# Altium schematic sheet PCIe.SchDoc: SPEC-A7
size 420 x 297 mm; Author: G.Kasprowicz; CompanyName: WUT ISE; DrawnBy: G.Kasprowicz; Organization: WUT ISE; Address1: PW ISE; Address2: Nowowiejska 15/19 00-665 Warsaw; Address3: gkasprow@gmail.com; Revision: 2; SheetNumber: 13; SheetTotal: 18; ModifiedBy: -; CheckedDate: -; Title2: PCIe connector; DivGrp: WUT ISE; Designer: G.Kasprowicz; ModifiedDate: -; ProjectName: Sensor Box
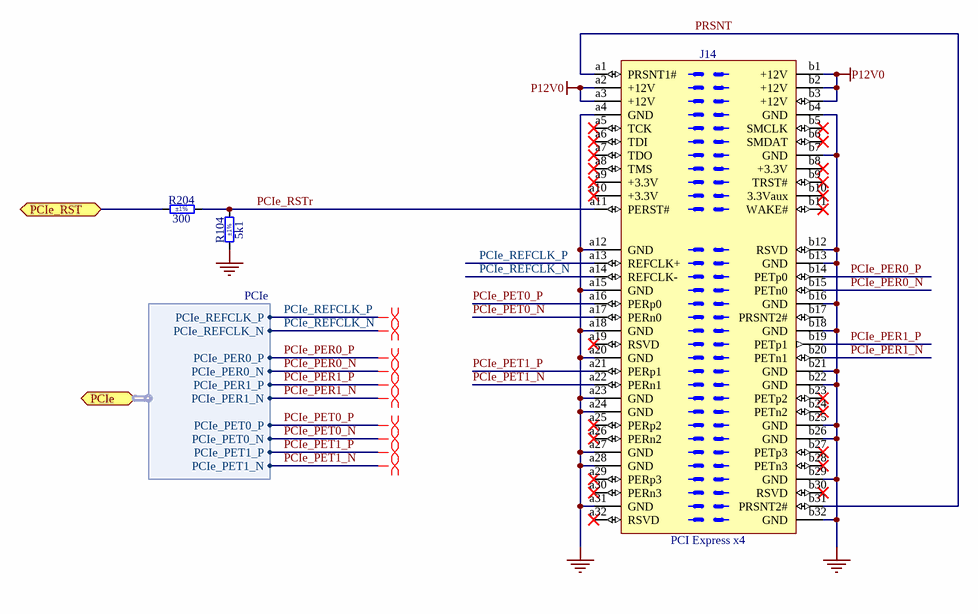
[diagram p0: PCIe.SchDoc]

## Parts
J14  PCI Express x4  [PCI Express x4]
R104  5k1  Tolerance: ±1%  [RESC1005X40N]
R204  300  Tolerance: ±1%  [RESC1005X40N]

## Ports
PCIe (bidir, harness PCIe, see SPEC-A7-TOP[2D], FPGA_MGT[2E]), PCIe_RST (bidir, see SPEC-A7-TOP[2D], FPGA_34[4D])

## Harnesses
PCIe: PCIe_REFCLK_P, PCIe_REFCLK_N, PCIe_PER0_P, PCIe_PER0_N, PCIe_PER1_P, PCIe_PER1_N, PCIe_PET0_P, PCIe_PET0_N, PCIe_PET1_P, PCIe_PET1_N

## Nets
GND: J14.a4(GND) J14.a12(GND) J14.a15(GND) J14.a18(GND) J14.a20(GND) J14.a23(GND) J14.a24(GND) J14.a27(GND) J14.a28(GND) J14.a31(GND) J14.b4(GND) J14.b7(GND) J14.b12(RSVD) J14.b13(GND) J14.b16(GND) J14.b18(GND) J14.b21(GND) J14.b22(GND) J14.b25(GND) J14.b26(GND) J14.b29(GND) J14.b32(GND) R104.1
P12V0: J14.a2(+12V) J14.a3(+12V) J14.b1(+12V) J14.b2(+12V) J14.b3(+12V)
PCIe_PER0_N: J14.b15(PETn0) ; port PCIe.PCIe_PER0_N
PCIe_PER0_P: J14.b14(PETp0) ; port PCIe.PCIe_PER0_P
PCIe_PER1_N: J14.b20(PETn1) ; port PCIe.PCIe_PER1_N
PCIe_PER1_P: J14.b19(PETp1) ; port PCIe.PCIe_PER1_P
PCIe_PET0_N: J14.a17(PERn0) ; port PCIe.PCIe_PET0_N
PCIe_PET0_P: J14.a16(PERp0) ; port PCIe.PCIe_PET0_P
PCIe_PET1_N: J14.a22(PERn1) ; port PCIe.PCIe_PET1_N
PCIe_PET1_P: J14.a21(PERp1) ; port PCIe.PCIe_PET1_P
PCIe_REFCLK_N: J14.a14(REFCLK-) ; port PCIe.PCIe_REFCLK_N
PCIe_REFCLK_P: J14.a13(REFCLK+) ; port PCIe.PCIe_REFCLK_P
PCIe_RST: R204.1 ; port PCIe_RST
PCIe_RSTr: J14.a11(PERST#) R104.2 R204.2
PRSNT: J14.a1(PRSNT1#) J14.b31(PRSNT2#)

Not connected (* = marked no-connect by the designer): J14 a5(TCK)* a6(TDI)* a7(TDO)* a8(TMS)* a9(+3.3V)* a10(+3.3V)* a19(RSVD)* a25(PERp2)* a26(PERn2)* a29(PERp3)* a30(PERn3)* a32(RSVD)* b5(SMCLK)* b6(SMDAT)* b8(+3.3V)* b9(TRST#)* b10(3.3Vaux)* b11(WAKE#)* b17(PRSNT2#) b23(PETp2)* b24(PETn2)* b27(PETp3)* b28(PETn3)* b30(RSVD)*

## Layout directives
differential pair: PCIe_PER0_N, PCIe_PER0_P, PCIe_PER1_N, PCIe_PER1_P, PCIe_PET0_N, PCIe_PET0_P, PCIe_PET1_N, PCIe_PET1_P, PCIe_REFCLK_N, PCIe_REFCLK_P

## Notes on the sheet
- Project/Equipment
- Document
- Designer
- Drawn by
- Check.by
- Copyright WUT ISE 2024.
  This documentation describes Open Hardware and is licensed under the CERN OHL v.2. You may redistribute and modify this documentation under the terms of the CERN OHL v.2. (http://ohwr.org/CERNOHL). This documentation is distributed WITHOUT ANY EXPRESS OR IMPLIED WARRANTY, INCLUDING OF MERCHANTABILITY, SATISFACTORY QUALITY AND FITNESS FOR A PARTICULAR PURPOSE. Please see the CERN OHL v.2 for applicable conditions.
- Contact
- File
- Last Mod.
- Print Date
- Sheet
- Size
- A3
- of
- Rev

## Library data of the parts
J14 = PCI Express x4: 64 contacts Board Eddge PCI Express x4 Connector; Part Description: 64 contacts Board Edge PCI Express x4 Connector; Manufacturer: PCI-SIG; Mounted: No; PressFit: No; Part Number: PCI Express x4; Component Kind: Standard (No BOM); Component Type: Standard (No BOM); Pin Count: 64; Family: PCI Express x4; Socket: No; SMD: No; Sense: No; Status: None; ComponentHeight: 0mm; HelpURL: \\cern.ch\dfs\Applications\Altium\Datasheets\PCI Express x4.pdf; Author: CERN DEM JLC; CreateDate: 03.12.2009; LatestRevisionDate: 14.12.2011
R104 = R0402_5K1_1%_0.0625W_100PPM: Resistor - 1%; Part Description: General Purpose Thick Film Chip Resistor; Manufacturer: GENERIC; Manufacturer1 Part Number: 232270675102L; TC: ±100ppm/°C; PressFit: No; Part Number: R0402_5K1_1%_0.0625W_100PPM; Component Kind: Standard; Component Type: Standard; Pin Count: 2; Value: 5k1; Status: Not Recommended; Power: 0.0625W; Manufacturer Part Number: R0402_5K1_1%_0.0625W_100PPM; Case: 0402; Mounted: Yes; Sense: No; Socket: No; SMD: Yes; Manufacturer1 Example: YAGEO PHYCOMP; Manufacturer1 ComponentHeight: 0.4mm; HelpURL: \\cern.ch\dfs\Applications\Altium\Datasheets\R0402_Phycomp_RC0402.pdf; Author: CERN DEM JLC; CreateDate: 03.12.2007; LatestRevisionDate: 17.10.2012
R204 = R0402_300R_1%_0.0625W_100PPM: Resistor - 1%; Part Description: General Purpose Thick Film Chip Resistor; Manufacturer: GENERIC; Manufacturer1 Part Number: 232270673001L; TC: ±100ppm/°C; PressFit: No; Part Number: R0402_300R_1%_0.0625W_100PPM; Component Kind: Standard; Component Type: Standard; Pin Count: 2; Value: 300; Status: Not Recommended; Power: 0.0625W; Manufacturer Part Number: R0402_300R_1%_0.0625W_100PPM; Case: 0402; Mounted: Yes; Sense: No; Socket: No; SMD: Yes; Manufacturer1 Example: YAGEO PHYCOMP; Manufacturer1 ComponentHeight: 0.4mm; HelpURL: \\cern.ch\dfs\Applications\Altium\Datasheets\R0402_Phycomp_RC0402.pdf; Author: CERN DEM JLC; CreateDate: 03.12.2007; LatestRevisionDate: 17.10.2012